# Altium schematic sheet Main.SchDoc
size 420 x 297 mm; DocumentNumber: 1; SheetNumber: 1; SheetTotal: 5; Обозначение_Код: RIG-00.00.001 Э3; Наименование1: Аппаратный модуль; Наименование3: РИГЛАБ; Наименование_организации: ООО "Риглаб"; п_Разраб_Р: Крепак В.; Вид_документа_SCH: Схема электрическая принципиальная; Дата_Разраб: 31.10.2025
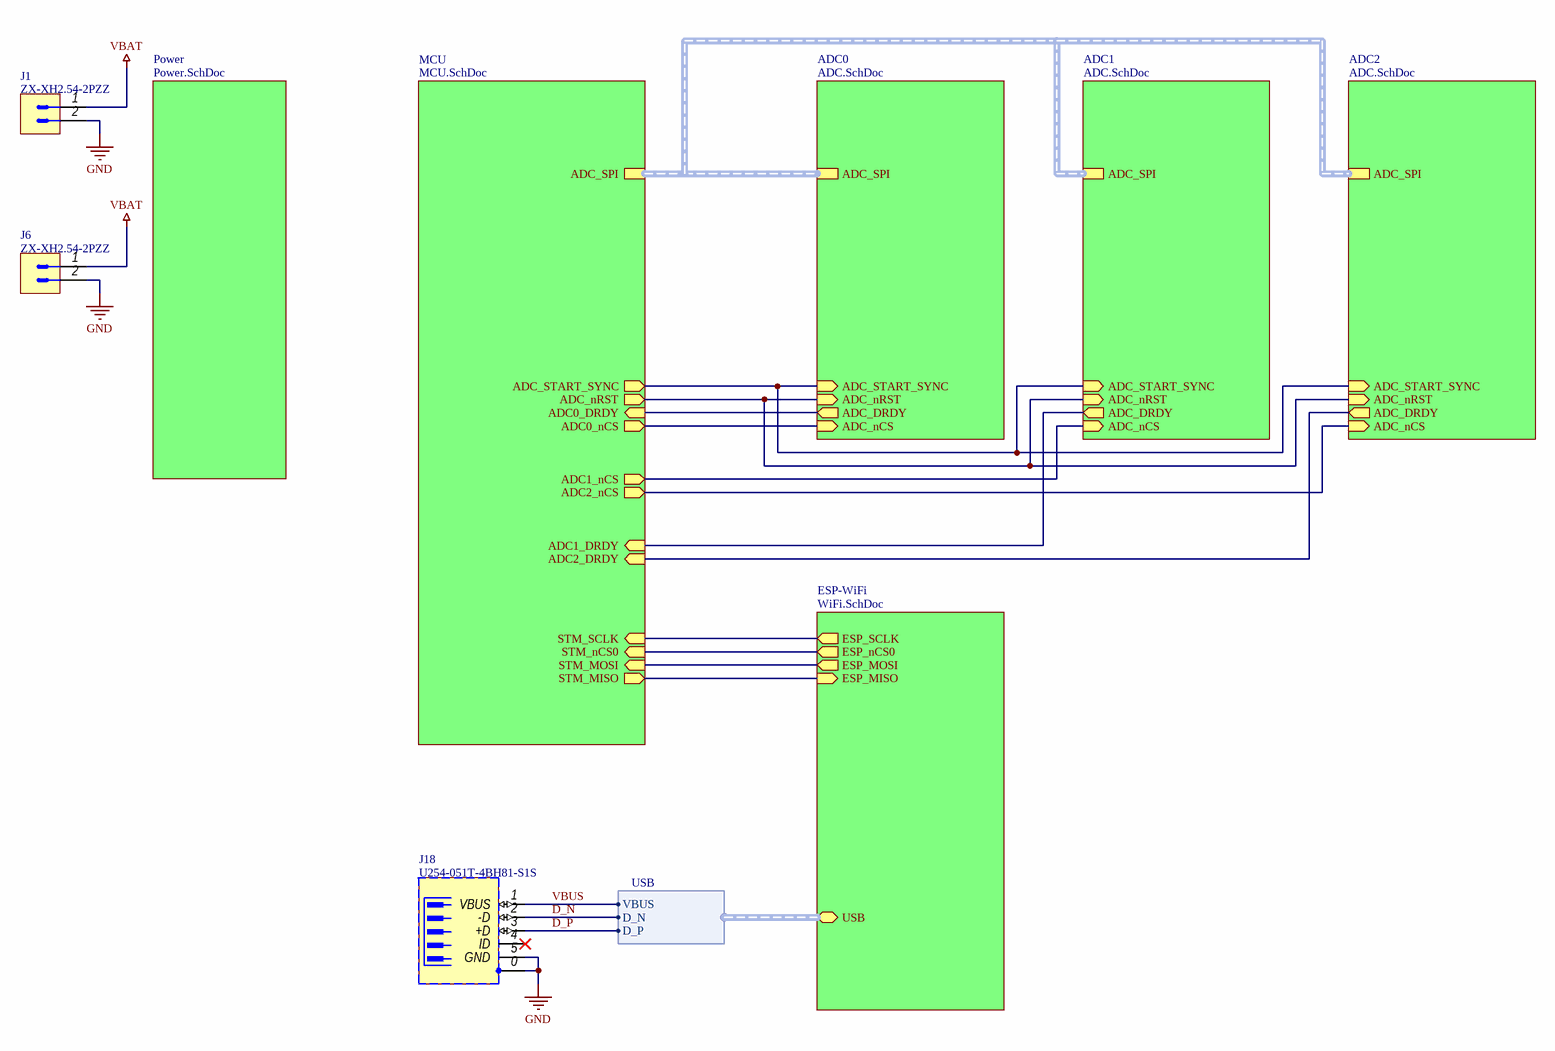
[diagram p0: Main.SchDoc]

## Parts
J1  ZX-XH2.54-2PZZ  [XH2.54-2PZZ]
J6  ZX-XH2.54-2PZZ  [XH2.54-2PZZ]
J18  U254-051T-4BH81-S1S  [U254-051T-4BH81-S1S]

## Sub-sheets
ADC0 = ADC.SchDoc: ADC_nRST (in), ADC_START_SYNC (in), ADC_nCS (in), ADC_DRDY (out), ADC_SPI (harness ADC_SPI)
ADC1 = ADC.SchDoc: ADC_nRST (in), ADC_START_SYNC (in), ADC_nCS (in), ADC_DRDY (out), ADC_SPI (harness ADC_SPI)
ADC2 = ADC.SchDoc: ADC_nRST (in), ADC_START_SYNC (in), ADC_nCS (in), ADC_DRDY (out), ADC_SPI (harness ADC_SPI)
ESP-WiFi = WiFi.SchDoc: ESP_SCLK (out), ESP_nCS0 (out), ESP_MOSI (out), ESP_MISO (in), USB (bidir, harness USB)
MCU = MCU.SchDoc: STM_SCLK (in), STM_nCS0 (in), STM_MOSI (in), STM_MISO (out), ADC_nRST (out), ADC_START_SYNC (out), ADC0_nCS (out), ADC0_DRDY (in), ADC_SPI (harness ADC_SPI), ADC1_nCS (out), ADC2_nCS (out), ADC1_DRDY (in), ADC2_DRDY (in)
Power = Power.SchDoc: no entries

## Harnesses
USB: D_N, D_P, VBUS

## Nets
GND: J1.2 J6.2 J18.0(SH) J18.5(GND)
VBAT: J1.1 J6.1
D_N: J18.2(-D) ; sheet ESP-WiFi/USB.D_N
D_P: J18.3(+D) ; sheet ESP-WiFi/USB.D_P
VBUS: J18.1(VBUS) ; sheet ESP-WiFi/USB.VBUS
(unnamed): sheet MCU/STM_SCLK, sheet ESP-WiFi/ESP_SCLK
(unnamed): sheet MCU/STM_nCS0, sheet ESP-WiFi/ESP_nCS0
(unnamed): sheet MCU/STM_MOSI, sheet ESP-WiFi/ESP_MOSI
(unnamed): sheet MCU/STM_MISO, sheet ESP-WiFi/ESP_MISO
(unnamed): sheet MCU/ADC_nRST, sheet ADC0/ADC_nRST, sheet ADC1/ADC_nRST, sheet ADC2/ADC_nRST
(unnamed): sheet MCU/ADC_START_SYNC, sheet ADC0/ADC_START_SYNC, sheet ADC1/ADC_START_SYNC, sheet ADC2/ADC_START_SYNC
(unnamed): sheet MCU/ADC0_nCS, sheet ADC0/ADC_nCS
(unnamed): sheet MCU/ADC0_DRDY, sheet ADC0/ADC_DRDY
(unnamed): sheet MCU/ADC1_nCS, sheet ADC1/ADC_nCS
(unnamed): sheet MCU/ADC2_nCS, sheet ADC2/ADC_nCS
(unnamed): sheet MCU/ADC1_DRDY, sheet ADC1/ADC_DRDY
(unnamed): sheet MCU/ADC2_DRDY, sheet ADC2/ADC_DRDY

Not connected (* = marked no-connect by the designer): J18 4(ID)*

## Buses and harness runs
harness sheet ADC0/ADC_SPI = sheet ADC1/ADC_SPI = sheet ADC2/ADC_SPI = sheet MCU/ADC_SPI

## Notes on the sheet
- Перв. примен.
- Справ. №
- Подп. дата
- Инв. № дубл.
- Взам. инв. №
- Подп. и дата
- Изм.
- Разраб.
- Лист
- № докум.
- Подп.
- Дата
- Лит.
- Масса
- Масштаб
- Пров.
- Т.контр.
- Листов
- Инв. № подл.
- Н.контр.
- Утв.
- ALTIUM GOSTBOM2.0 KEV
- Файл:
- Копировал
- Формат А3

## Library data of the parts
J1 J6 = ZX-XH2.54-2PZZ: 1x2P XH 1 2.54mm Tin Male pin 2 260℃ -25℃~+85℃ Brass 3A Straight Plugin,P=2.54mm Wire To Board / Wire To Wire Connector ROHS; ID: 48; Table: Connectors - Общ; Part Number: ZX-XH2.54-2PZZ; Device: ZX-XH2.54-2PZZ; Type: Connector; SMD: No; Status: Active; Price: 0; Price2: 0; Price3: 0; Author: Krepak V.; CreateDate: 19.02.2024
J18 = U254-051T-4BH81-S1S: USB 2.0 1.8A 1 260℃ Surface Mount，Right Angle 5P Female -40℃~+85℃ Gold Copper Alloy Micro-B SMD USB Connectors ROHS; ID: 34; Table: Connectors - Интерфейсы; Part Number: U254-051T-4BH81-S1S; Device: U254-051T-4BH81-S1S; Series: U254-051T-4BH81-S1S; Type: Connector; Price: 0; Price2: 0; Price3: 0; Author: Krepak V.; CreateDate: 09.04.2024